# Altium schematic sheet RP2354A.SchDoc: MCU
size A; DrawnBy: Sindre Hovland; Organization: Open sauce; Revision: V0; SheetNumber: 4; SheetTotal: 5
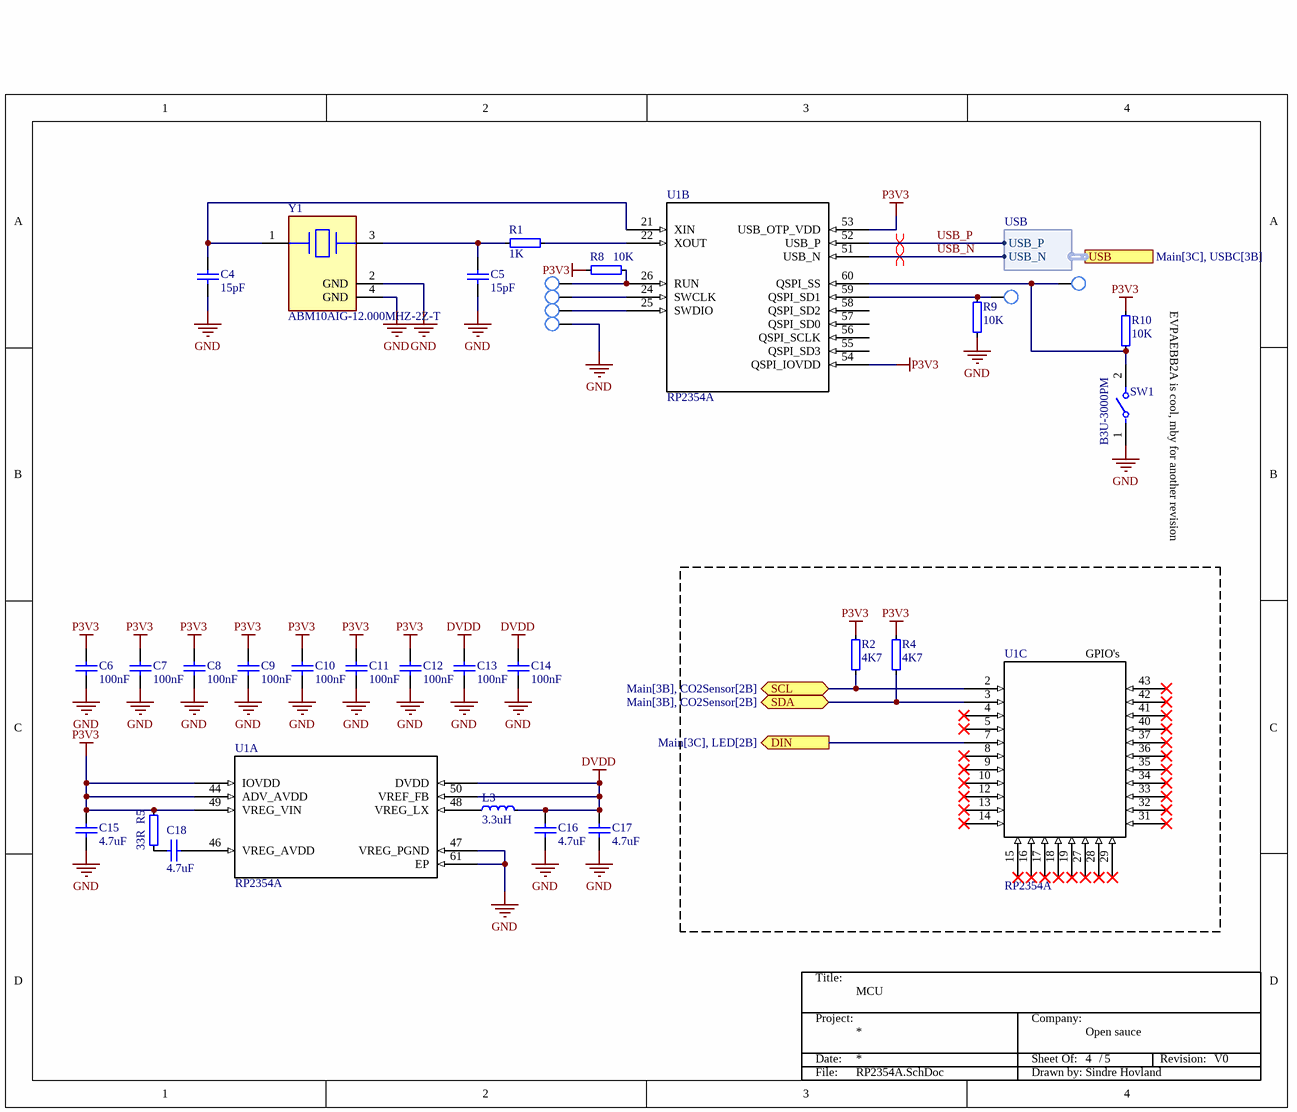
[diagram p0: RP2354A.SchDoc]

## Parts
*?  TitleBlock  (value not drawn)  (graphical)
C4  15pF  [C0201]
C5  15pF  [C0201]
C6  100nF  [C0201]
C7  100nF  [C0201]
C8  100nF  [C0201]
C9  100nF  [C0201]
C10  100nF  [C0201]
C11  100nF  [C0201]
C12  100nF  [C0201]
C13  100nF  [C0201]
C14  100nF  [C0201]
C15  4.7uF  [C0402]
C16  4.7uF  [C0402]
C17  4.7uF  [C0402]
C18  4.7uF  [C0402]
GND  DNP  [TP_SMD_1.0mm]  (value not drawn)
L3  3.3uH  [IND0805]
R1  1K  [R0201]
R2  4K7  [R0201]
R4  4K7  [R0201]
R5  33R  [RES0402]
R8  10K  [R0201]
R9  10K  [R0201]
R10  10K  [R0201]
RUN  DNP  [TP_SMD_1.0mm]  (value not drawn)
SD1  DNP  [TP_SMD_1.0mm]  (value not drawn)
SS  DNP  [TP_SMD_1.0mm]  (value not drawn)
SW1  B3U-3000PM  [FP-B3U-3000PM-MFG]
SWCLK  DNP  [TP_SMD_1.0mm]  (value not drawn)
SWDIO  DNP  [TP_SMD_1.0mm]  (value not drawn)
U1  RP2354A  [RP2354A]  (parts A,B,C of 3)
Y1  ABM10AIG-12.000MHZ-2Z-T  [FP-ABM10AIG-MFG]

## Ports
DIN (out, see Main[3C], LED[2B]), SCL (bidir, see Main[3B], CO2Sensor[2B]), SDA (bidir, see Main[3B], CO2Sensor[2B]), USB (harness USB, see Main[3C], USBC[3B])

## Harnesses
USB: USB_N, USB_P

## Nets
DVDD: C13.1 C14.1 C16.2 C17.2 L3.2 U1.6,23,39(DVDD) U1.50(VREF_FB)
GND: C4.2 C5.1 C6.2 C7.2 C8.2 C9.2 C10.2 C11.2 C12.2 C13.2 C14.2 C15.1 C16.1 C17.1 GND.1 R9.2 SW1.1 U1.47(VREG_PGND) U1.61(EP) Y1.2(GND) Y1.4(GND)
P3V3: C6.1 C7.1 C8.1 C9.1 C10.1 C11.1 C12.1 C15.2 R2.2 R4.2 R5.2 R8.1 R10.1 U1.1,11,30,38,45,20(IOVDD) U1.44(ADV_AVDD) U1.49(VREG_VIN) U1.53(USB_OTP_VDD) U1.54(QSPI_IOVDD)
DIN: U1.7 ; port DIN
SCL: R2.1 U1.2 ; port SCL
SDA: R4.1 U1.3 ; port SDA
USB_N: U1.51(USB_N) ; port USB.USB_N
USB_P: U1.52(USB_P) ; port USB.USB_P
NetC4_1: C4.1 U1.21(XIN) Y1.1(1_Crystal)
NetC5_2: C5.2 R1.2 Y1.3(2_Crystal)
NetC18_1: C18.1 R5.1
NetC18_2: C18.2 U1.46(VREG_AVDD)
NetL3_1: L3.1 U1.48(VREG_LX)
NetR1_1: R1.1 U1.22(XOUT)
NetR8_2: R8.2 RUN.1 U1.26(RUN)
NetR9_1: R9.1 SD1.1 U1.59(QSPI_SD1)
NetR10_2: R10.2 SS.1 SW1.2 U1.60(QSPI_SS)
NetSWCLK_1: SWCLK.1 U1.24(SWCLK)
NetSWDIO_1: SWDIO.1 U1.25(SWDIO)

Not connected (* = marked no-connect by the designer): U1 4* 5* 8* 9* 10* 12* 13* 14* 15* 16* 17* 18* 19* 27* 28* 29* 31* 32* 33* 34* 35* 36* 37* 40* 41* 42* 43* 55(QSPI_SD3) 56(QSPI_SCLK) 57(QSPI_SD0) 58(QSPI_SD2)

## Layout directives
differential pair: USB_N, USB_P

## Notes on the sheet
- EVPAEBB2A is cool, mby for another revision
- (in symbol RP2354A, part C) GPIO's
- (in symbol TitleBlock) Title:; Project:; Company:; Date:; Sheet Of:; /; Revision:; File:; Drawn by:

## Library data of the parts
C4-C18 = CAP: Capacitor; Value: 100pF; Published: 8-Jun-2000; Revision: July-2002: Re-released for DXP Platform.; Publisher: Altium Limited
GND RUN SD1 SS SWCLK SWDIO = TP
L3 = IND: Inductor; Part Number: FB0402-120R@100M-500mA; Manufacturer: Murata; Manufacturer Part Number: BLM15AG121SN1D; Part number IPS: N.A.; Value: 120R/0.55A; Note: Chip EMIFIL Inductor Type Chip Ferrite Bead; Artikkelnr Noca: 33029317; Footprint Doc: 0402; LatestRevisionDate: 2014-01-10; Pin Count: 2; Publisher: Nordic Semiconductor; Published: 2011-11-14; ComponentLink1URL: *; ComponentLink1Description: Datasheet; ComponentLink2URL: *; ComponentLink2Description: Supplier link; HelpURL: http://search.murata.co.jp/Ceramy/image/img/PDF/ENG/L0110S0100BLM15A_SN.pdf
R1 R2 R4 R5 R8-R10 = RES: Resistor, Generic; Part Number: R0201-0R; Part number IPS: 00000003245; Value: 0R; Note: Chip Res 5%; Artikkelnr Noca: N.A.; Manufacturer: *; Manufacturer Part Number: *; ComponentLink1URL: *; ComponentLink1Description: Datasheet; ComponentLink2URL: *; ComponentLink2Description: Supplier link; HelpURL: *; Footprint Doc: 0201; LatestRevisionDate: 2017-11-09; Pin Count: 2; Publisher: Nordic Semiconductor; Published: 2014-11-13; Supplier 1: *; Supplier Part Number 1: *; Supplier 2: *; Supplier Part Number 2: *
SW1 = CMP-08834-000057-1: SWITCH TACTILE SPST-NO 0.05A 12V; Connector Type: SMD/SMT; Switch Travel: 0.2mm; Throw Configuration: SPST; Illumination Type: Non-Illuminated; Mechanical Life: 100000Cycles; Actuator Length: 0.7mm; Switch Function: Off-Mom; Ratings: Dust Proof; Operating Force: 1.59N; Max Current Rating: 50mA; Contact Resistance: 100mR; Termination: Gull Wing; Packaging: Tape and Reel; Case/Package: SMD/SMT; Orientation: Right Angle; Package Quantity: 1000; Mount: Surface Mount; Series: B3U; Max Voltage Rating (DC): 12V; Depth: 3.2mm; Max Operating Temperature: 70°C; RoHS Compliant: Yes; Weight: 0.022g; Min Operating Temperature: -25°C; Electrical Life: 100000Cycles; Current Rating: 50mA; Length: 4mm; Voltage Rating (DC): 12V
U1 = RP2354A: RP2354A: 30 GPIO, 7x7 QFN60, 2MB stacked flash
Y1 = CMP-27762-010436-1: CRYSTAL 12.0000MHZ 10PF SMD